# EAGLE design ZippyTheBalancingRobot (EAGLE 7.7.0)
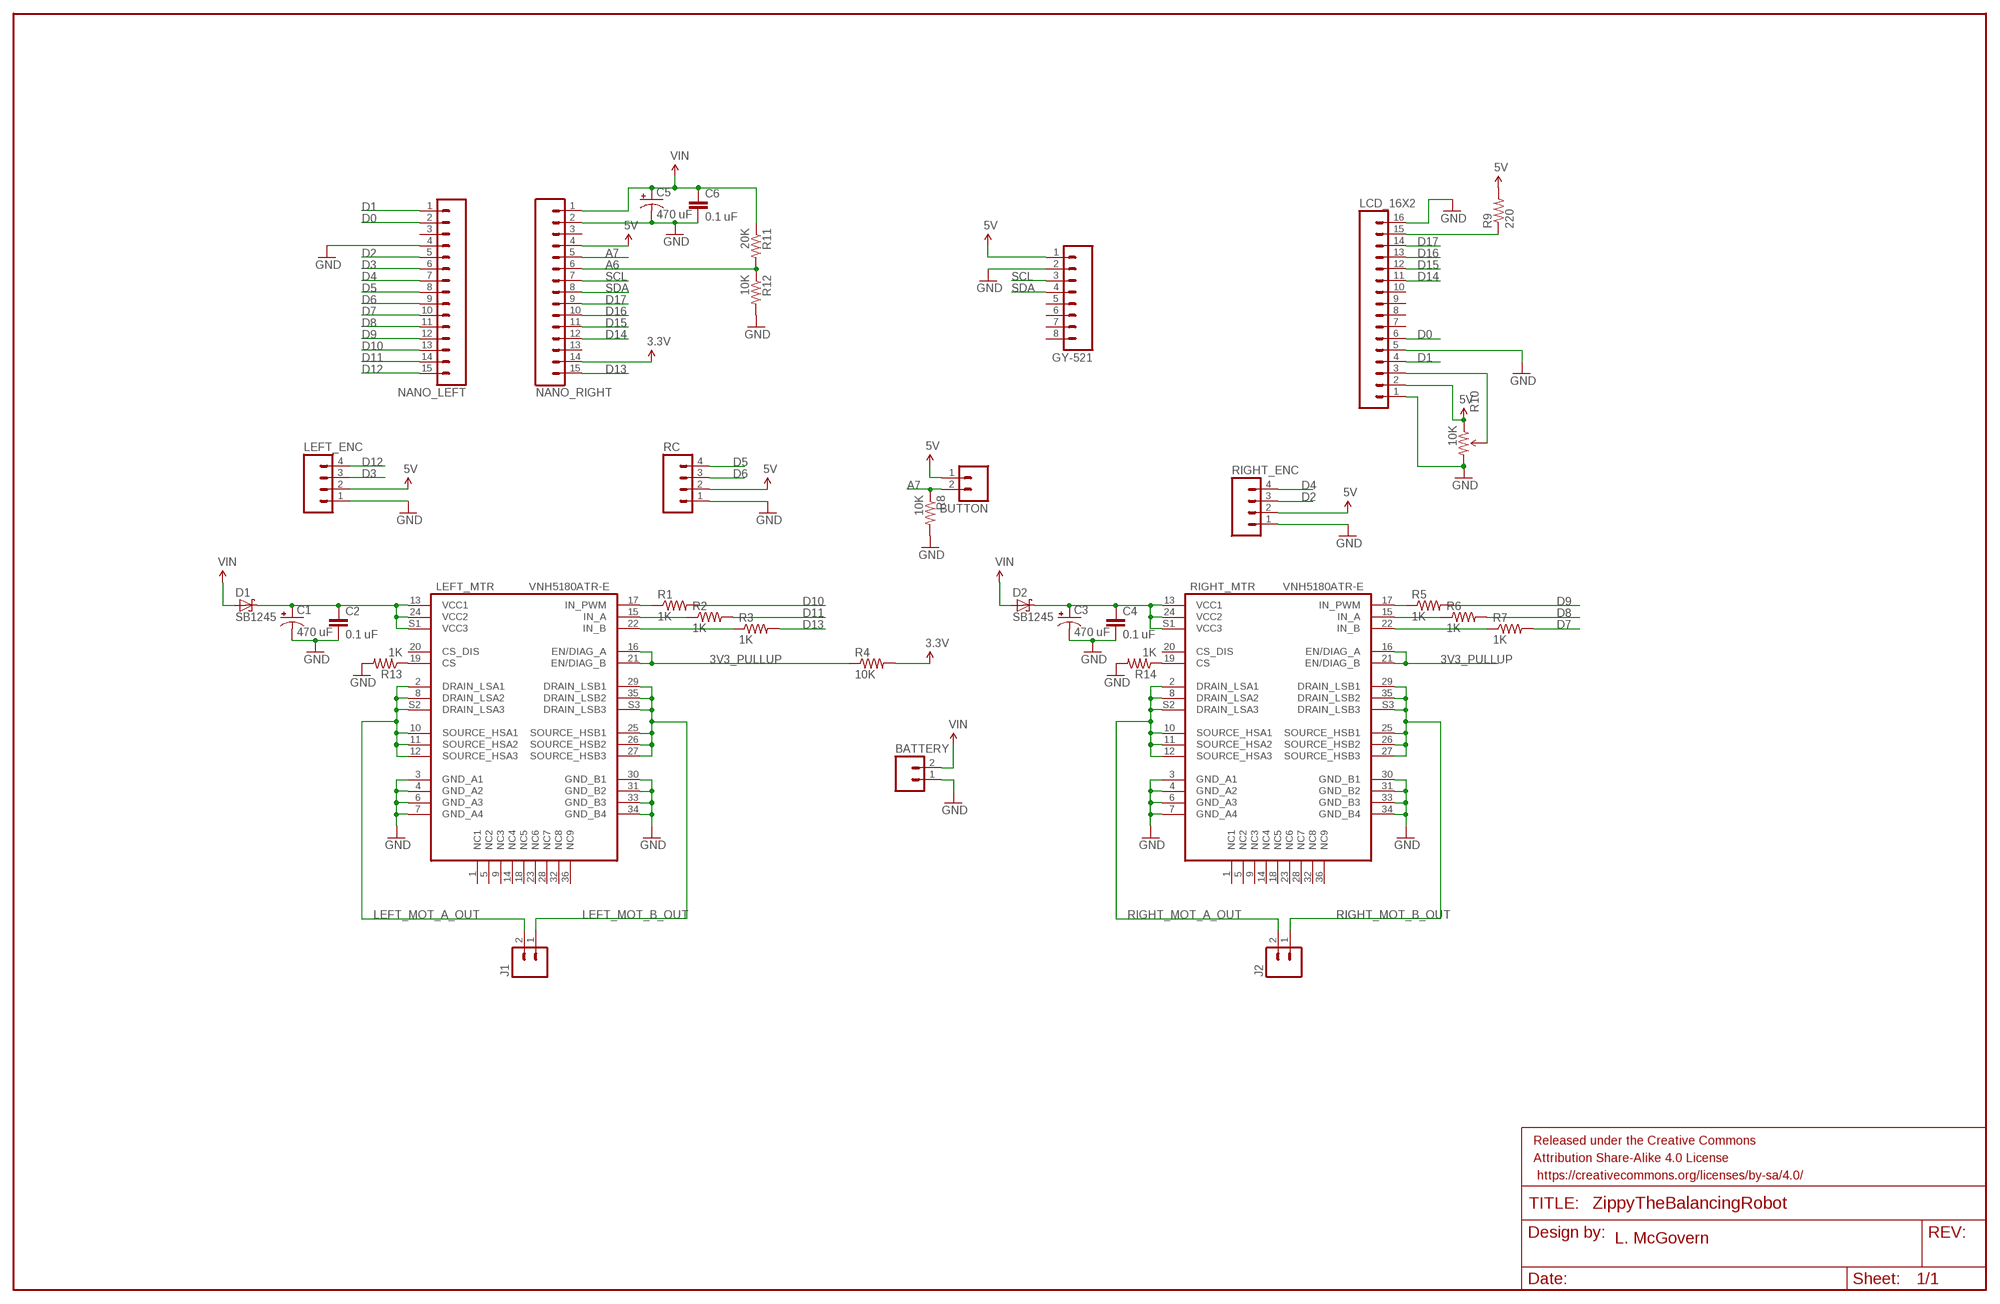
[diagram p0: schematic, sheet 1]

## Parts
BATTERY  M025MM  [SCREWTERMINAL-5MM-2]
BUTTON  M02PTH  [1X02]
C1  470 uF  CPOL-USE3.5-8  [E3,5-8]
C2  0.1 uF  CAPPTH  [CAP-PTH-SMALL]
C3  470 uF  CPOL-USE3.5-8  [E3,5-8]
C4  0.1 uF  CAPPTH  [CAP-PTH-SMALL]
C5  470 uF  CPOL-USE3.5-8  [E3,5-8]
C6  0.1 uF  CAPPTH  [CAP-PTH-SMALL]
D1  SB1245  SCHOTTKY-DIODEDO201T15  [DO201T15]
D2  SB1245  SCHOTTKY-DIODEDO201T15  [DO201T15]
FRAME1  FRAME-LEDGER  [CREATIVE_COMMONS]
GY-521  M08  [1X08_ROUND]
J1  M025MM  [SCREWTERMINAL-5MM-2]
J2  M025MM  [SCREWTERMINAL-5MM-2]
LCD_16X2  M16PTH  [1X16]
LEFT_ENC  M04PTH  [1X04]
LEFT_MTR  VNH5180ATR-E  [POWERSSO-36]
NANO_LEFT  M15  [1X15]
NANO_RIGHT  M15  [1X15]
R1  1K  R-US_0207/10  [0207/10]
R2  1K  R-US_0207/10  [0207/10]
R3  1K  R-US_0207/10  [0207/10]
R4  10K  R-US_0207/10  [0207/10]
R5  1K  R-US_0207/10  [0207/10]
R6  1K  R-US_0207/10  [0207/10]
R7  1K  R-US_0207/10  [0207/10]
R8  10K  R-US_0207/10  [0207/10]
R9  220  R-US_0207/10  [0207/10]
R10  10K  TRIMPOT-PTH-KNOB  [3386U]
R11  20K  R-US_0207/10  [0207/10]
R12  10K  R-US_0207/10  [0207/10]
R13  1K  R-US_0207/10  [0207/10]
R14  1K  R-US_0207/10  [0207/10]
RC  M04PTH  [1X04]
RIGHT_ENC  M04PTH  [1X04]
RIGHT_MTR  VNH5180ATR-E  [POWERSSO-36]

## Nets
3.3V: NANO_RIGHT.14 R4.2
3V3_PULLUP: LEFT_MTR.16(EN/DIAG_A) LEFT_MTR.21(EN/DIAG_B) R4.1 RIGHT_MTR.16(EN/DIAG_A) RIGHT_MTR.21(EN/DIAG_B)
5V: BUTTON.1 GY-521.1 LCD_16X2.2 LEFT_ENC.2 NANO_RIGHT.4 R9.2 R10.1(CCW) RC.2 RIGHT_ENC.2
A6: NANO_RIGHT.6 R11.2 R12.1
A7: BUTTON.2 NANO_RIGHT.5 R8.1
D0: LCD_16X2.6 NANO_LEFT.2
D1: LCD_16X2.4 NANO_LEFT.1
D2: NANO_LEFT.5 RIGHT_ENC.3
D3: LEFT_ENC.3 NANO_LEFT.6
D4: NANO_LEFT.7 RIGHT_ENC.4
D5: NANO_LEFT.8 RC.4
D6: NANO_LEFT.9 RC.3
D7: NANO_LEFT.10 R7.2
D8: NANO_LEFT.11 R6.2
D9: NANO_LEFT.12 R5.2
D10: NANO_LEFT.13 R1.2
D11: NANO_LEFT.14 R2.2
D12: LEFT_ENC.4 NANO_LEFT.15
D13: NANO_RIGHT.15 R3.2
D14: LCD_16X2.11 NANO_RIGHT.12
D15: LCD_16X2.12 NANO_RIGHT.11
D16: LCD_16X2.13 NANO_RIGHT.10
D17: LCD_16X2.14 NANO_RIGHT.9
GND: BATTERY.1 C1.- C2.2 C3.- C4.2 C5.- C6.2 GY-521.2 LCD_16X2.1 LCD_16X2.5 LCD_16X2.16 LEFT_ENC.1 LEFT_MTR.3(GND_A1) LEFT_MTR.4(GND_A2) LEFT_MTR.6(GND_A3) LEFT_MTR.7(GND_A4) LEFT_MTR.30(GND_B1) LEFT_MTR.31(GND_B2) LEFT_MTR.33(GND_B3) LEFT_MTR.34(GND_B4) NANO_LEFT.4 NANO_RIGHT.2 R8.2 R10.3(CW) R12.2 R13.2 R14.2 RC.1 RIGHT_ENC.1 RIGHT_MTR.3(GND_A1) RIGHT_MTR.4(GND_A2) RIGHT_MTR.6(GND_A3) RIGHT_MTR.7(GND_A4) RIGHT_MTR.30(GND_B1) RIGHT_MTR.31(GND_B2) RIGHT_MTR.33(GND_B3) RIGHT_MTR.34(GND_B4)
L_IN_A: LEFT_MTR.15(IN_A) R2.1
L_IN_B: LEFT_MTR.22(IN_B) R3.1
L_IN_PWM: LEFT_MTR.17(IN_PWM) R1.1
LED+: LCD_16X2.15 R9.1
LEFT_MOT_A_OUT: J1.2 LEFT_MTR.2(DRAIN_LSA1) LEFT_MTR.8(DRAIN_LSA2) LEFT_MTR.10(SOURCE_HSA1) LEFT_MTR.11(SOURCE_HSA2) LEFT_MTR.12(SOURCE_HSA3) LEFT_MTR.S2(DRAIN_LSA3)
LEFT_MOT_B_OUT: J1.1 LEFT_MTR.25(SOURCE_HSB1) LEFT_MTR.26(SOURCE_HSB2) LEFT_MTR.27(SOURCE_HSB3) LEFT_MTR.29(DRAIN_LSB1) LEFT_MTR.35(DRAIN_LSB2) LEFT_MTR.S3(DRAIN_LSB3)
N$1: LEFT_MTR.19(CS) R13.1
N$3: R14.1 RIGHT_MTR.19(CS)
N$7: C1.+ C2.1 D1.C LEFT_MTR.13(VCC1) LEFT_MTR.24(VCC2) LEFT_MTR.S1(VCC3)
N$10: C3.+ C4.1 D2.C RIGHT_MTR.13(VCC1) RIGHT_MTR.24(VCC2) RIGHT_MTR.S1(VCC3)
R_IN_A: R6.1 RIGHT_MTR.15(IN_A)
R_IN_B: R7.1 RIGHT_MTR.22(IN_B)
R_IN_PWM: R5.1 RIGHT_MTR.17(IN_PWM)
RIGHT_MOT_A_OUT: J2.2 RIGHT_MTR.2(DRAIN_LSA1) RIGHT_MTR.8(DRAIN_LSA2) RIGHT_MTR.10(SOURCE_HSA1) RIGHT_MTR.11(SOURCE_HSA2) RIGHT_MTR.12(SOURCE_HSA3) RIGHT_MTR.S2(DRAIN_LSA3)
RIGHT_MOT_B_OUT: J2.1 RIGHT_MTR.25(SOURCE_HSB1) RIGHT_MTR.26(SOURCE_HSB2) RIGHT_MTR.27(SOURCE_HSB3) RIGHT_MTR.29(DRAIN_LSB1) RIGHT_MTR.35(DRAIN_LSB2) RIGHT_MTR.S3(DRAIN_LSB3)
SCL: GY-521.3 NANO_RIGHT.7
SDA: GY-521.4 NANO_RIGHT.8
V0: LCD_16X2.3 R10.2(WIPER)
VIN: BATTERY.2 C5.+ C6.1 D1.A D2.A NANO_RIGHT.1 R11.1
Unconnected: GY-521.5 GY-521.6 GY-521.7 GY-521.8 LCD_16X2.7 LCD_16X2.8 LCD_16X2.9 LCD_16X2.10 LEFT_MTR.1(NC1) LEFT_MTR.5(NC2) LEFT_MTR.9(NC3) LEFT_MTR.14(NC4) LEFT_MTR.18(NC5) LEFT_MTR.20(CS_DIS) LEFT_MTR.23(NC6) LEFT_MTR.28(NC7) LEFT_MTR.32(NC8) LEFT_MTR.36(NC9) NANO_LEFT.3 NANO_RIGHT.3 NANO_RIGHT.13 RIGHT_MTR.1(NC1) RIGHT_MTR.5(NC2) RIGHT_MTR.9(NC3) RIGHT_MTR.14(NC4) RIGHT_MTR.18(NC5) RIGHT_MTR.20(CS_DIS) RIGHT_MTR.23(NC6) RIGHT_MTR.28(NC7) RIGHT_MTR.32(NC8) RIGHT_MTR.36(NC9)

## Notes on the sheet
- L. McGovern

## Library data of the parts
BATTERY J1 J2 = SparkFun-Connectors:M02: Standard 2-pin 0.1" header. Use with - straight break away headers ( PRT-00116) - right angle break away headers (PRT-00553) - swiss pins (PRT-00743) - machine pins (PRT-00117) - female headers (PRT-00115) Molex polarized connector foot print use with: PRT-08233 with associated crimp pins and housings. 2.54_SCREWTERM for use with PRT-10571. 3.5mm Screw Terminal footprints for PRT-08084 5mm Screw Terminal footprints for use with PRT-08432; STOREFRONT_ID: PRT-08432
BUTTON = SparkFun-Connectors:M02: Standard 2-pin 0.1" header. Use with - straight break away headers ( PRT-00116) - right angle break away headers (PRT-00553) - swiss pins (PRT-00743) - machine pins (PRT-00117) - female headers (PRT-00115) Molex polarized connector foot print use with: PRT-08233 with associated crimp pins and housings. 2.54_SCREWTERM for use with PRT-10571. 3.5mm Screw Terminal footprints for PRT-08084 5mm Screw Terminal footprints for use with PRT-08432
C1 C3 C5 = adafruit:CPOL-US: POLARIZED CAPACITOR, American symbol
C2 C4 C6 = SparkFun-Capacitors:CAP: Capacitor Standard 0603 ceramic capacitor, and 0.1" leaded capacitor.
D1 D2 = adafruit:SCHOTTKY-DIODE: Schottky Diode
FRAME1 = SparkFun-Aesthetics:FRAME-LEDGER: Schematic Frame Standard 11x14 US Ledger frame
GY-521 = SparkFun-Connectors:M08: Header 8 Standard 8-pin 0.1" header. Use with straight break away headers (SKU : PRT-00116), right angle break away headers (PRT-00553), swiss pins (PRT-00743), machine pins (PRT-00117), and female headers (PRT-00115).; PROD_ID: CONN-08437
LCD_16X2 = SparkFun-Connectors:M16: 1x16 .1" header
LEFT_ENC RC RIGHT_ENC = SparkFun-Connectors:M04: Header 4 Standard 4-pin 0.1" header. Use with straight break away headers (SKU : PRT-00116), right angle break away headers (PRT-00553), swiss pins (PRT-00743), machine pins (PRT-00117), and female headers (PRT-00115). Molex polarized connector foot print use with SKU : PRT-08231 with associated crimp pins and housings. 1MM SMD Version SKU: PRT-10208; PROD_ID: CONN-09696
LEFT_MTR RIGHT_MTR = TKJMixed:VNH5180ATR-E
NANO_LEFT NANO_RIGHT = SparkFun-Connectors:M15: Header 15 Standard 15-pin 0.1" header. Use with straight break away headers (SKU : PRT-00116), right angle break away headers (PRT-00553), swiss pins (PRT-00743), machine pins (PRT-00117), and female headers (PRT-00115).
R1-R9 R11-R14 = resistor:R-US_: RESISTOR, American symbol
R10 = SparkFun-Electromechanical:TRIMPOT: Various small potentiometers for "set-and-forget" applications; PROD_ID: RES-09730; VALUE: TSR-3386

## Board
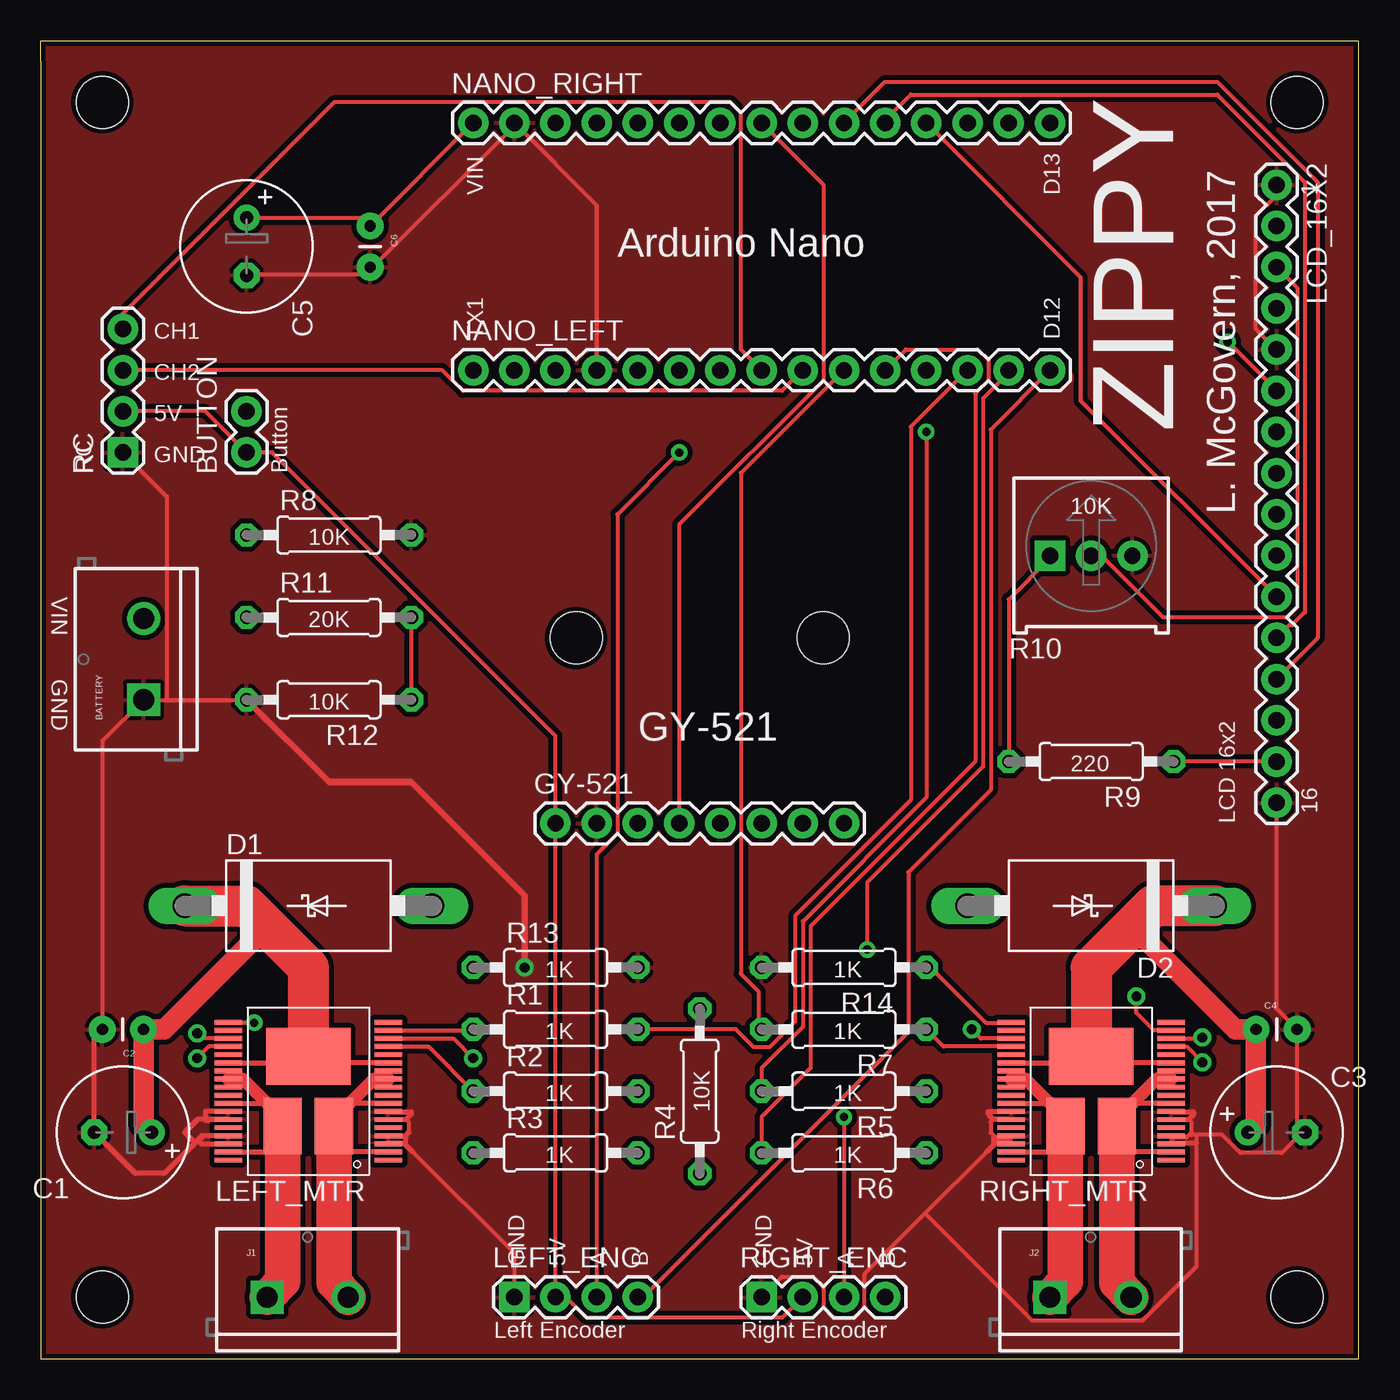
[diagram p1: board, top side]
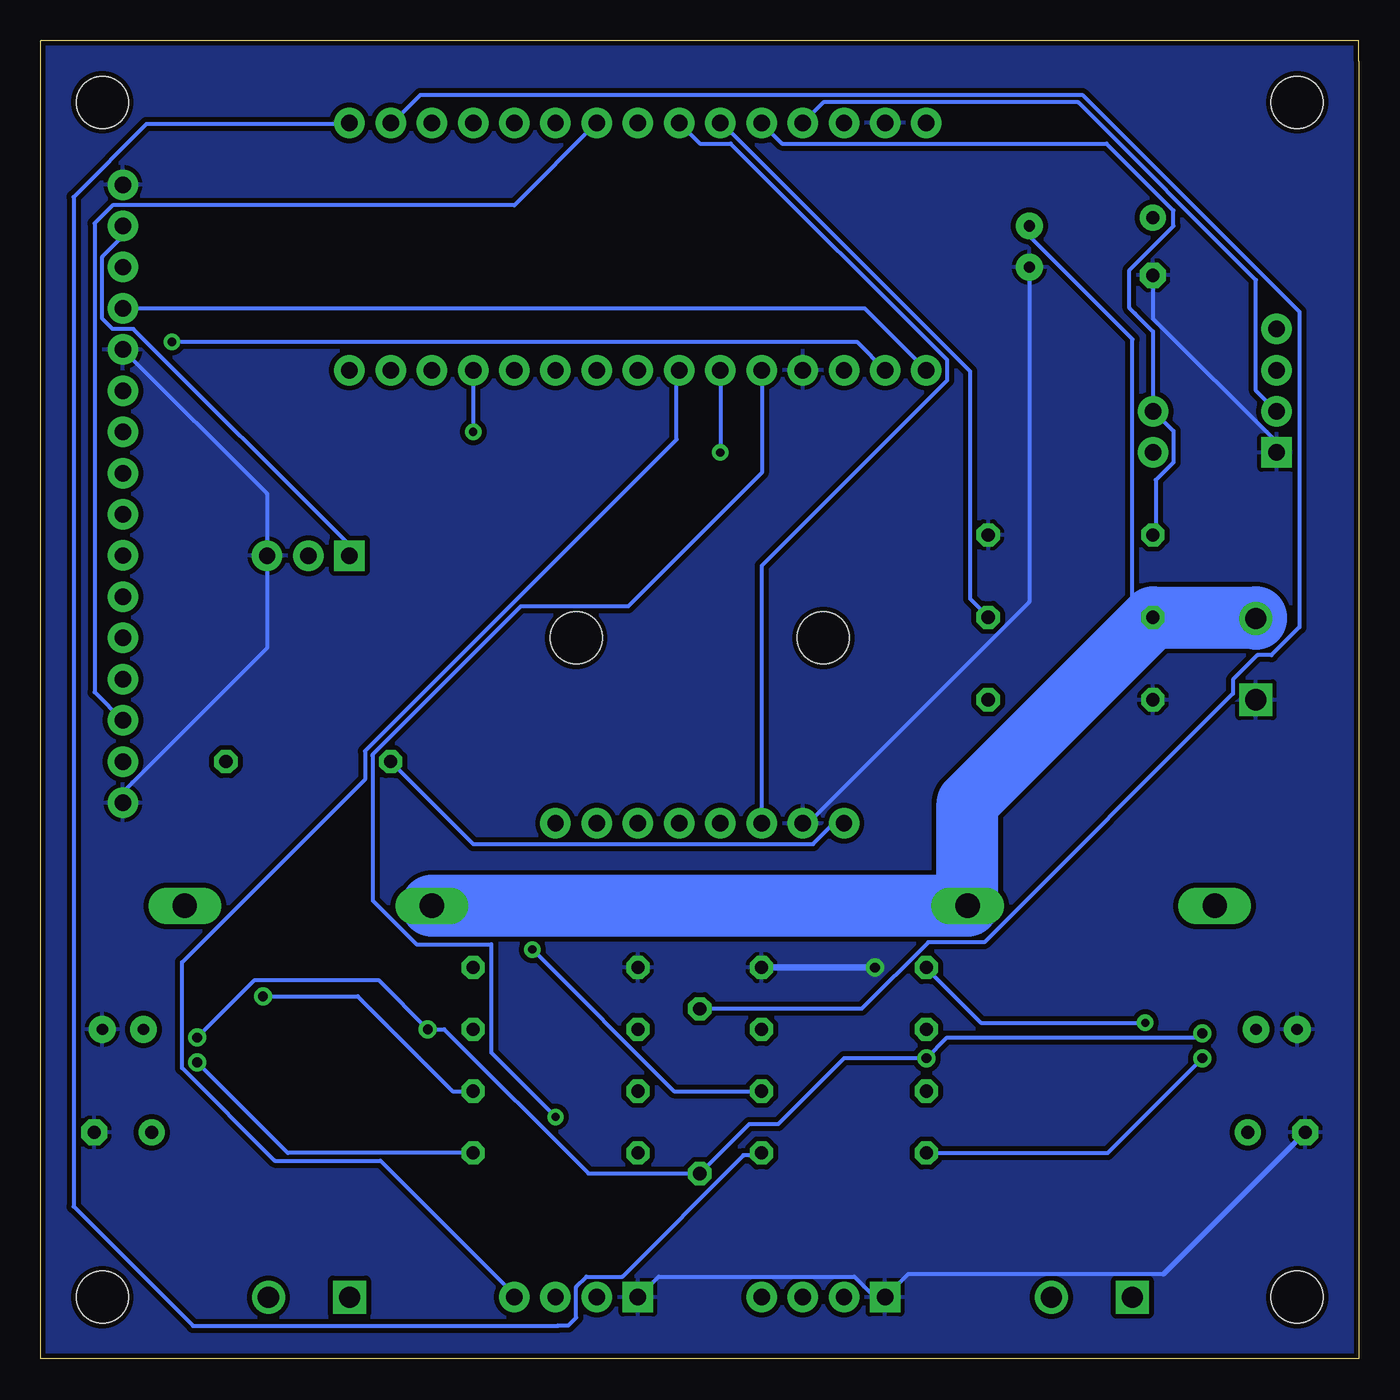
[diagram p2: board, bottom side, seen from below]

Size 81.28 x 81.28 mm. Coordinates in mm from the lower left corner, seen from the top.
Outline: 0,80 0,0 81.28,0 81.28,81.28 0,81.28 0,80.01
Copper layers (1*16): Top 0.035mm / dielectric 1.5mm / Bottom 0.035mm
Design rules "SparkFun *": minimum track width 10mil, minimum drill 20mil, track to track 7mil, track to pad 7mil, pad to pad 7mil, via to via 7mil, smd to smd 7mil, copper to edge 8mil, drill to drill 8mil, minimum pad ring 12mil, minimum via ring 10mil, stop-mask expansion 4mil, vias tented up to drill 20mil, thermal gap 10mil
Holes 3.2 mm at 3.81,3.81 3.81,77.47 33.02,44.45 48.26,44.45 77.47,3.81 77.47,77.47

### Footprints (pad centres in the part's own frame; a part is rotated, then mirrored left to right if it is on the bottom)
SCREWTERMINAL-5MM-2 = drill 1.3 pad 2.032 square: 1 0,0 | drill 1.3 pad 2.032: 2 5,0
1X02 = drill 1.016 pad 1.88: 1 0,0; 2 2.54,0
E3,5-8 = drill 0.813 pad 1.6: + -1.778,0 | drill 0.813 pad 1.6 octagon: - 1.778,0
CAP-PTH-SMALL = drill 0.7 pad 1.651: 1 0,0; 2 2.54,0
DO201T15 = drill 1.499 long: A 7.62,0; C -7.62,0
1X08_ROUND = drill 1.016 pad 1.88: 1 0,0; 2 2.54,0; 3 5.08,0; 4 7.62,0; 5 10.16,0; 6 12.7,0; 7 15.24,0; 8 17.78,0
1X16 = drill 1.016 pad 1.88: 1 0,0; 2 2.54,0; 3 5.08,0; 4 7.62,0; 5 10.16,0; 6 12.7,0; 7 15.24,0; 8 17.78,0; 9 20.32,0; 10 22.86,0; 11 25.4,0; 12 27.94,0; 13 30.48,0; 14 33.02,0; 15 35.56,0; 16 38.1,0
1X04 = drill 1.016 pad 1.88 square: 1 0,0 | drill 1.016 pad 1.88: 2 2.54,0; 3 5.08,0; 4 7.62,0
POWERSSO-36 = smd 1.7 x 0.3: 1 -4.933,4.25; 2 -4.933,3.75; 3 -4.933,3.25; 4 -4.933,2.75; 5 -4.933,2.25; 6 -4.933,1.75; 7 -4.933,1.25; 8 -4.933,0.75; 9 -4.933,0.25; 10 -4.933,-0.25; 11 -4.933,-0.75; 12 -4.933,-1.25; 13 -4.933,-1.75; 14 -4.933,-2.25; 15 -4.933,-2.75; 16 -4.933,-3.25; 17 -4.933,-3.75; 18 -4.933,-4.25; 19 4.933,-4.25; 20 4.933,-3.75; 21 4.933,-3.25; 22 4.933,-2.75; 23 4.933,-2.25; 24 4.933,-1.75; 25 4.933,-1.25; 26 4.933,-0.75; 27 4.933,-0.25; 28 4.933,0.25; 29 4.933,0.75; 30 4.933,1.25; 31 4.933,1.75; 32 4.933,2.25; 33 4.933,2.75; 34 4.933,3.25; 35 4.933,3.75; 36 4.933,4.25 | smd 5.2 x 3.5: S1 0,-2.15 | smd 2.35 x 3.5: S2 -1.575,2.15; S3 1.575,2.15
1X15 = drill 1.016 pad 1.88: 1 0,0; 2 2.54,0; 3 5.08,0; 4 7.62,0; 5 10.16,0; 6 12.7,0; 7 15.24,0; 8 17.78,0; 9 20.32,0; 10 22.86,0; 11 25.4,0; 12 27.94,0; 13 30.48,0; 14 33.02,0; 15 35.56,0
0207/10 = drill 0.813 octagon: 1 -5.08,0; 2 5.08,0
3386U = drill 1.016 pad 1.88 square: 1 -2.54,-0.015 | drill 1.016 pad 1.88: 2 0,-0.015; 3 2.54,-0.015

### Placement (x,y rotation side)
BATTERY  6.35,40.64 90 top
BUTTON  12.7,55.88 90 top
C1  5.08,13.97 180 top
C2  6.35,20.32 180 top
C3  76.2,13.97 0 top
C4  74.93,20.32 0 top
C5  12.7,68.58 270 top
C6  20.32,69.85 270 top
D1  16.51,27.94 0 top
D2  64.77,27.94 180 top
FRAME1  -30.48,-8.89 0 top  (outside the outline)
GY-521  31.75,33.02 0 top
J1  13.97,3.81 0 top
J2  62.23,3.81 0 top
LCD_16X2  76.2,72.39 270 top
LEFT_ENC  29.21,3.81 0 top
LEFT_MTR  16.51,16.51 180 top
NANO_LEFT  26.67,60.96 0 top
NANO_RIGHT  26.67,76.2 0 top
R1  31.75,20.32 0 top
R2  31.75,16.51 0 top
R3  31.75,12.7 0 top
R4  40.64,16.51 90 top
R5  49.53,16.51 180 top
R6  49.53,12.7 180 top
R7  49.53,20.32 180 top
R8  17.78,50.8 0 top
R9  64.77,36.83 180 top
R10  64.77,49.53 0 top
R11  17.78,45.72 0 top
R12  17.78,40.64 180 top
R13  31.75,24.13 0 top
R14  49.53,24.13 180 top
RC  5.08,55.88 90 top
RIGHT_ENC  44.45,3.81 0 top
RIGHT_MTR  64.77,16.51 180 top

### Tracks (layer width: path | path; a pad name or v marks a point on that pad's centre or on a via)
3.3V
  Bottom 0.254: R4.2 30.66,21.59 26.56,25.69 23.1,25.69 7.77,41.02 7.77,41.88 6.26,43.4 5.4,43.4 3.67,45.12 3.67,64.55 17.06,77.94 57.86,77.94 59.59,76.21 NANO_RIGHT.14
3V3_PULLUP  (via drill 0.6)
  Top 0.254: RIGHT_MTR.16 71.58,19.76 v71.63,19.81 | RIGHT_MTR.21 57.96,19.76 v57.4,20.32 | LEFT_MTR.21 9.96,19.76 v9.65,20.07 | LEFT_MTR.16 25.45,19.76 v26.67,18.54
  Bottom 0.254: v71.63,19.81 68.07,23.37 60.45,23.37 v57.4,20.32 56.39,20.32 47.5,11.43 R4.1 37.59,14.48 35.81,14.48 31.75,18.54 v26.67,18.54 25.4,19.81 9.91,19.81 v9.65,20.07
5V
  Top 0.254: RC.2 10.16,58.42 BUTTON.1 14.29,55.88 31.75,38.42 GY-521.1 LEFT_ENC.2 32.38,3.81 33.66,2.54 45.72,2.54 RIGHT_ENC.2 | R9.2 59.69,46.83 62.23,49.37 R10.1
  Bottom 0.254: RC.2 6.35,59.69 6.35,66.52 17.3,77.47 33.02,77.47 NANO_RIGHT.4 | LCD_16X2.2 76.2,69.22 77.47,67.94 77.47,64.14 76.83,63.5 75.56,63.5 62.23,50.16 R10.1 | GY-521.1 32.38,33.02 33.66,31.75 54.61,31.75 R9.2
A6
  Top 0.254: R11.2 R12.1
  Bottom 0.254: NANO_RIGHT.6 39.29,76 38.86,75.56 38.65,75.56 23.96,60.88 23.96,46.85 22.89,45.77 R11.2
A7
  Bottom 0.254: NANO_RIGHT.5 35.56,74.93 15.56,74.93 11.43,70.8 11.43,69.85 14.15,67.13 14.15,64.8 13.81,64.46 13.81,64.45 12.7,63.34 BUTTON.2 12.52,58.29 11.44,57.21 11.44,55.27 12.52,54.19 12.52,50.95 R8.1
D0  (via drill 0.51)
  Top 0.254: LCD_16X2.6 v73.18,62.71
  Bottom 0.254: v73.18,62.71 30.96,62.71 NANO_LEFT.2
D1
  Bottom 0.254: LCD_16X2.4 30.48,64.77 NANO_LEFT.1
D2  (via drill 0.51)
  Top 0.254: v49.53,14.92 RIGHT_ENC.3
  Bottom 0.254: NANO_LEFT.5 36.8,60.81 36.8,54.63 45.03,46.41 51.66,46.41 60.81,37.26 60.8,37.15 60.8,28.26 58.1,25.56 53.5,25.56 53.5,18.89 v49.53,14.92
D3  (via drill 0.51)
  Top 0.254: LEFT_ENC.3 34.29,31.11 35.56,32.38 35.56,52.07 v39.37,55.88
  Bottom 0.254: NANO_LEFT.6 v39.37,55.88
D4
  Bottom 0.254: NANO_LEFT.7 42.06,60.81 42.06,56.69 61.27,37.49 61.28,37.47 61.28,35.72 72.55,24.45 72.55,17.94 66.83,12.22 60.33,12.22 52.07,3.97 RIGHT_ENC.4 52.12,3.89
D5
  Top 0.254: RC.4 5.08,64.45 18.1,77.47 42.55,77.47 43.18,76.83 43.18,62.23 NANO_LEFT.8
D6
  Top 0.254: RC.3 24.77,60.96 26.04,59.69 45.72,59.69 NANO_LEFT.9
D7
  Top 0.254: R7.2 44.26,20.51 44.26,22.67 43.18,23.75 43.18,54.62 49.44,60.88 NANO_LEFT.10
D8
  Top 0.254: R6.2 44.45,14.92 47.47,17.94 47.47,26.67 57.63,36.83 57.63,59.53 58.42,60.33 58.42,61.59 57.78,62.23 53.34,62.23 NANO_LEFT.11
D9  (via drill 0.51)
  Top 0.254: R5.2 44.45,17.94 46.99,20.48 46.99,26.99 54.61,34.61 v54.61,57.15
  Bottom 0.254: NANO_LEFT.12 v54.61,57.15
D10
  Top 0.254: R1.2 42.86,20.32 43.97,19.21 44.93,19.21 46.51,20.8 46.51,27.3 53.66,34.45 53.66,57.47 NANO_LEFT.13
D11  (via drill 0.51)
  Top 0.254: v50.96,25.24 50.96,29.37 58.1,36.51 58.1,59.21 59.69,60.8 NANO_LEFT.14
  Bottom 0.254: R2.2 42.23,16.51 v50.96,25.24
D12
  Top 0.254: LEFT_ENC.4 37.15,3.81 53.5,20.16 53.5,30 58.58,35.08 58.58,57.31 NANO_LEFT.15
D13
  Bottom 0.254: 37.95,12.57 37.94,12.57 | 37.94,12.57 37.03,12.57 R3.2 | NANO_RIGHT.15 62.41,76.12 74.75,76.12 79.25,71.63 79.25,9.4 71.88,2.03 49.4,2.03 49.37,2.06 48.74,2.06 48.26,2.54 48.26,4.45 47.62,5.08 45.4,5.08 37.94,12.54 37.94,12.57
D14
  Top 0.254: NANO_RIGHT.12 64.14,66.67 64.14,59.05 LCD_16X2.11
D15
  Top 0.254: LCD_16X2.12 76.99,45.24 77.15,45.24 77.95,46.04 77.95,72.55 72.55,77.95 53.66,77.95 52.07,76.36 NANO_RIGHT.11
D16
  Top 0.254: NANO_RIGHT.10 52.07,78.74 72.55,78.74 78.74,72.55 78.74,44.45 LCD_16X2.13
D17
  Bottom 0.254: NANO_RIGHT.9 52.07,71.12 76.83,71.12 77.95,70.01 77.95,41.12 LCD_16X2.14
GND  (via drill 0.6)
  Top 0.254: 77.47,13.65 C4.2 76.2,21.59 LCD_16X2.16 | LCD_16X2.1 76.2,71.75 74.93,70.48 74.93,63.5 LCD_16X2.5 | NANO_LEFT.4 34.29,71.12 NANO_RIGHT.2 29.21,76.04 20.32,67.15 C6.2 19.84,66.83 12.7,66.83 C5.- | 7.78,40.64 BATTERY.1 3.81,38.1 C2.2 | 7.78,40.64 R12.2 | 7.78,40.64 7.78,53.18 RC.1 | 69.69,13.34 RIGHT_MTR.3 | 69.69,13.65 RIGHT_MTR.4 69.85,13.65 | RIGHT_MTR.6 69.85,14.76 | 69.69,15.24 RIGHT_MTR.7 | 70.88,13.89 70.96,13.97 70.96,14.61 70.8,14.76 | 70.88,13.89 70.64,13.65 | 71.28,13.81 72.87,13.81 73.98,12.7 76.52,12.7 77.47,13.65 | 71.28,13.81 70.96,13.81 70.88,13.89 | 77.47,13.65 C3.- | 59.85,13.34 RIGHT_MTR.34 | 59.85,13.65 RIGHT_MTR.33 59.69,13.65 | RIGHT_MTR.31 59.69,14.76 | 59.85,15.24 RIGHT_MTR.30 | 58.82,13.73 58.58,13.97 58.58,14.61 58.74,14.76 | 58.82,13.73 58.9,13.65 | 21.43,13.34 LEFT_MTR.3 | LEFT_MTR.6 21.59,14.76 | 21.43,15.24 LEFT_MTR.7 | 22.46,13.73 22.7,13.97 22.7,14.61 22.54,14.76 | 22.46,13.73 22.38,13.65 | LEFT_ENC.1 29.21,6.51 22.94,12.78 22.54,13.18 22.54,13.65 22.46,13.73 | 54.53,8.97 50.8,5.24 50.8,3.17 50.16,2.54 48.9,2.54 48.26,3.17 48.26,4.45 47.62,5.08 45.72,5.08 RIGHT_ENC.1 | 54.53,8.97 58.34,12.78 58.74,13.18 58.74,13.65 58.82,13.73 | 71.28,13.81 71.28,13.31 71.28,5.71 67.94,2.38 61.12,2.38 54.53,8.97
  Top 0.305: 70.64,13.65 69.85,13.65 | 69.85,14.76 70.8,14.76 71.09,15.06 71.09,15.21 71.07,15.24 69.69,15.24 | 58.9,13.65 59.69,13.65 | 59.69,14.76 58.74,14.76 58.42,15.08 58.42,15.24 59.85,15.24 | 21.59,14.76 22.54,14.76 22.86,15.08 22.86,15.24 21.43,15.24 | 21.43,13.34 22.38,13.34 22.94,12.78 | LEFT_MTR.4 22.49,13.76 22.7,13.97 | 59.85,13.34 58.9,13.34 58.34,12.78 | 69.69,13.34 71.25,13.34 71.28,13.31 | LEFT_MTR.34 9.93,13.26 9.78,13.41 9.78,13.51 10.03,13.76 LEFT_MTR.33 9.95,13.76 9.53,13.34 | LEFT_MTR.30 10.18,15.26 10.16,15.24 10.16,14.73 10.19,14.71 10.34,14.71 10.39,14.76 LEFT_MTR.31 9.68,14.76 8.89,13.97 9.53,13.34 | 9.53,13.34 7.62,11.43 5.84,11.43 C1.- 3.3,19.81 C2.2
  Top 0.406: v29.84,24.13 29.84,28.57 22.86,35.56 17.78,35.56 R12.2
  Bottom 0.254: LCD_16X2.5 67.31,53.34 R10.3 67.31,43.81 76.2,34.92 LCD_16X2.16 | RIGHT_ENC.1 43.18,5.08 31.11,5.08 29.84,3.81 LEFT_ENC.1 27.78,5.24 12.06,5.24 | RC.1 5.08,56.52 12.7,64.14 C5.- | GY-521.2 33.97,33.02 20.32,46.67 C6.2
  Bottom 0.305: 12.06,5.24 12.03,5.24 C1.-
  Bottom 0.406: R13.2 v29.84,24.13
  pour Top (isolate 0.305): 0,81.28 81.28,81.28 81.28,0 0,0
  pour Bottom (isolate 0.305): 0,81.28 81.28,81.28 81.28,0 0,0
L_IN_A
  Top 0.254: LEFT_MTR.15 23.92,19.26 R2.1
L_IN_B  (via drill 0.6)
  Top 0.254: LEFT_MTR.22 10.37,19.26 v9.65,18.54
  Bottom 0.254: R3.1 15.49,12.7 v9.65,18.54
L_IN_PWM
  Top 0.254: LEFT_MTR.17 26.67,20.26 R1.1
LED+
  Top 0.254: LCD_16X2.15 R9.1
LEFT_MOT_A_OUT
  Top 0.254: LEFT_MTR.12 LEFT_MTR.11 LEFT_MTR.10 | 17.94,15.4 LEFT_MTR.S2
  Top 0.305: LEFT_MTR.2 18.23,12.76 arc45 18.09,12.7 | LEFT_MTR.8 19.05,15.76 18.41,15.76 arc45 18.23,15.69 17.94,15.4 17.78,15.24
  Top 0.813: LEFT_MTR.11 20.66,17.26 arc45 20.48,17.19 19.05,15.76
  Top 2.184: LEFT_MTR.S2 18.09,12.7 18.09,4.7 J1.2
LEFT_MOT_B_OUT
  Top 0.254: LEFT_MTR.27 LEFT_MTR.26 LEFT_MTR.25 | 15.08,15.4 LEFT_MTR.S3
  Top 0.305: LEFT_MTR.35 14.79,12.76 arc-45 14.94,12.7 | LEFT_MTR.29 13.97,15.76 14.62,15.76 arc-45 14.79,15.69 15.08,15.4 15.24,15.24
  Top 0.813: LEFT_MTR.26 12.37,17.26 arc-45 12.54,17.19 13.97,15.76
  Top 2.184: LEFT_MTR.S3 14.94,12.7 14.94,4.78 J1.1
N$1  (via drill 0.51)
  Top 0.254: v13.17,20.73 11.66,20.73 LEFT_MTR.19
  Bottom 0.254: v13.17,20.73 23.32,20.73 26.56,23.96 R13.1
N$3
  Top 0.254: RIGHT_MTR.19 59.8,20.73 58.29,20.73 55.05,23.96 54.62,23.96 R14.1
N$7
  Top 0.254: 15.16,17.86 15.4,18.1 LEFT_MTR.S1 17.62,18.1 17.86,17.86
  Top 0.305: LEFT_MTR.24 14.76,18.26 15.16,17.86 15.24,17.78 | LEFT_MTR.13 18.26,18.26 17.86,17.86 17.78,17.78
  Top 1.27: 13.97,26.67 7.62,20.32 C2.1 6.35,14.48 C1.+
  Top 2.54: D1.C 12.7,27.94 13.97,26.67 16.51,24.13 LEFT_MTR.S1
N$10
  Top 0.305: RIGHT_MTR.24 64.77,18.26 | RIGHT_MTR.13 64.77,18.26 | 64.77,18.26 RIGHT_MTR.S1
  Top 1.27: 67.31,26.67 73.66,20.32 C4.1 74.93,14.48 C3.+
  Top 2.54: D2.C 68.58,27.94 67.31,26.67 64.77,24.13 RIGHT_MTR.S1
R_IN_A  (via drill 0.6)
  Top 0.254: RIGHT_MTR.15 70.66,19.26 v71.63,18.29
  Bottom 0.254: R6.1 66.04,12.7 v71.63,18.29
R_IN_B
  Top 0.254: RIGHT_MTR.22 55.67,19.26 R7.1
R_IN_PWM  (via drill 0.6)
  Top 0.254: RIGHT_MTR.17 68.64,20.26 67.56,21.34 v67.56,22.35
  Bottom 0.254: v67.56,22.35 61.72,22.35 55.88,16.51 R5.1
RIGHT_MOT_A_OUT
  Top 0.254: RIGHT_MTR.10 69.69,16.83 RIGHT_MTR.11 69.69,17.62 RIGHT_MTR.12
  Top 0.305: RIGHT_MTR.2 66.41,12.76 66.34,12.7 | RIGHT_MTR.8 67.31,15.76 66.34,15.76 RIGHT_MTR.S2
  Top 0.813: RIGHT_MTR.11 68.81,17.26 67.31,15.76
  Top 2.184: RIGHT_MTR.S2 66.34,12.7 66.34,4.7 J2.2
RIGHT_MOT_B_OUT
  Top 0.254: RIGHT_MTR.27 59.85,16.83 RIGHT_MTR.26 59.85,17.62 RIGHT_MTR.25
  Top 0.305: RIGHT_MTR.35 63.13,12.76 63.2,12.7 | RIGHT_MTR.29 62.23,15.76 62.98,15.76 63.5,15.24 63.5,14.36 RIGHT_MTR.S3
  Top 0.813: RIGHT_MTR.26 60.73,17.26 62.23,15.76
  Top 2.184: RIGHT_MTR.S3 63.2,12.7 63.2,4.78 J2.1
SCL
  Bottom 0.254: GY-521.3 36.83,48.9 25.4,60.33 25.4,61.59 38.73,74.93 40.64,74.93 NANO_RIGHT.7
SDA
  Top 0.254: GY-521.4 39.37,51.44 48.26,60.33 48.26,72.39 NANO_RIGHT.8
V0
  Top 0.254: LCD_16X2.3 77.47,66.04 77.47,46.35 76.83,45.72 69.22,45.72 65.56,49.37 64.77,49.37 R10.2
VIN
  Top 0.254: C5.+ 12.7,70.33 19.84,70.33 C6.1 NANO_RIGHT.1
  Bottom 0.254: C6.1 20.32,69.22 13.97,62.87 13.97,46.99 R11.1
  Bottom 3.81: BATTERY.2 6.35,45.72 R11.1 24.13,34.29 D1.A D2.A

### Text on the board
tPlace: VIN | D13 | 1 | Arduino Nano | CH1 | TX1 | D12 | CH2 | 5V | ZIPPY | RC | GND | Button | 10K | L. McGovern, 2017 | 10K | VIN | 20K | GND | 10K | GY-521 | 220 | 16 | LCD 16x2 | 1K | 1K | 1K | 1K | 1K | 1K | 10K | 1K | 1K | GND | 5V | A | B | GND | 5V | A | B | Left Encoder | Right Encoder